# Altium schematic sheet Outputs.SchDoc
size A1
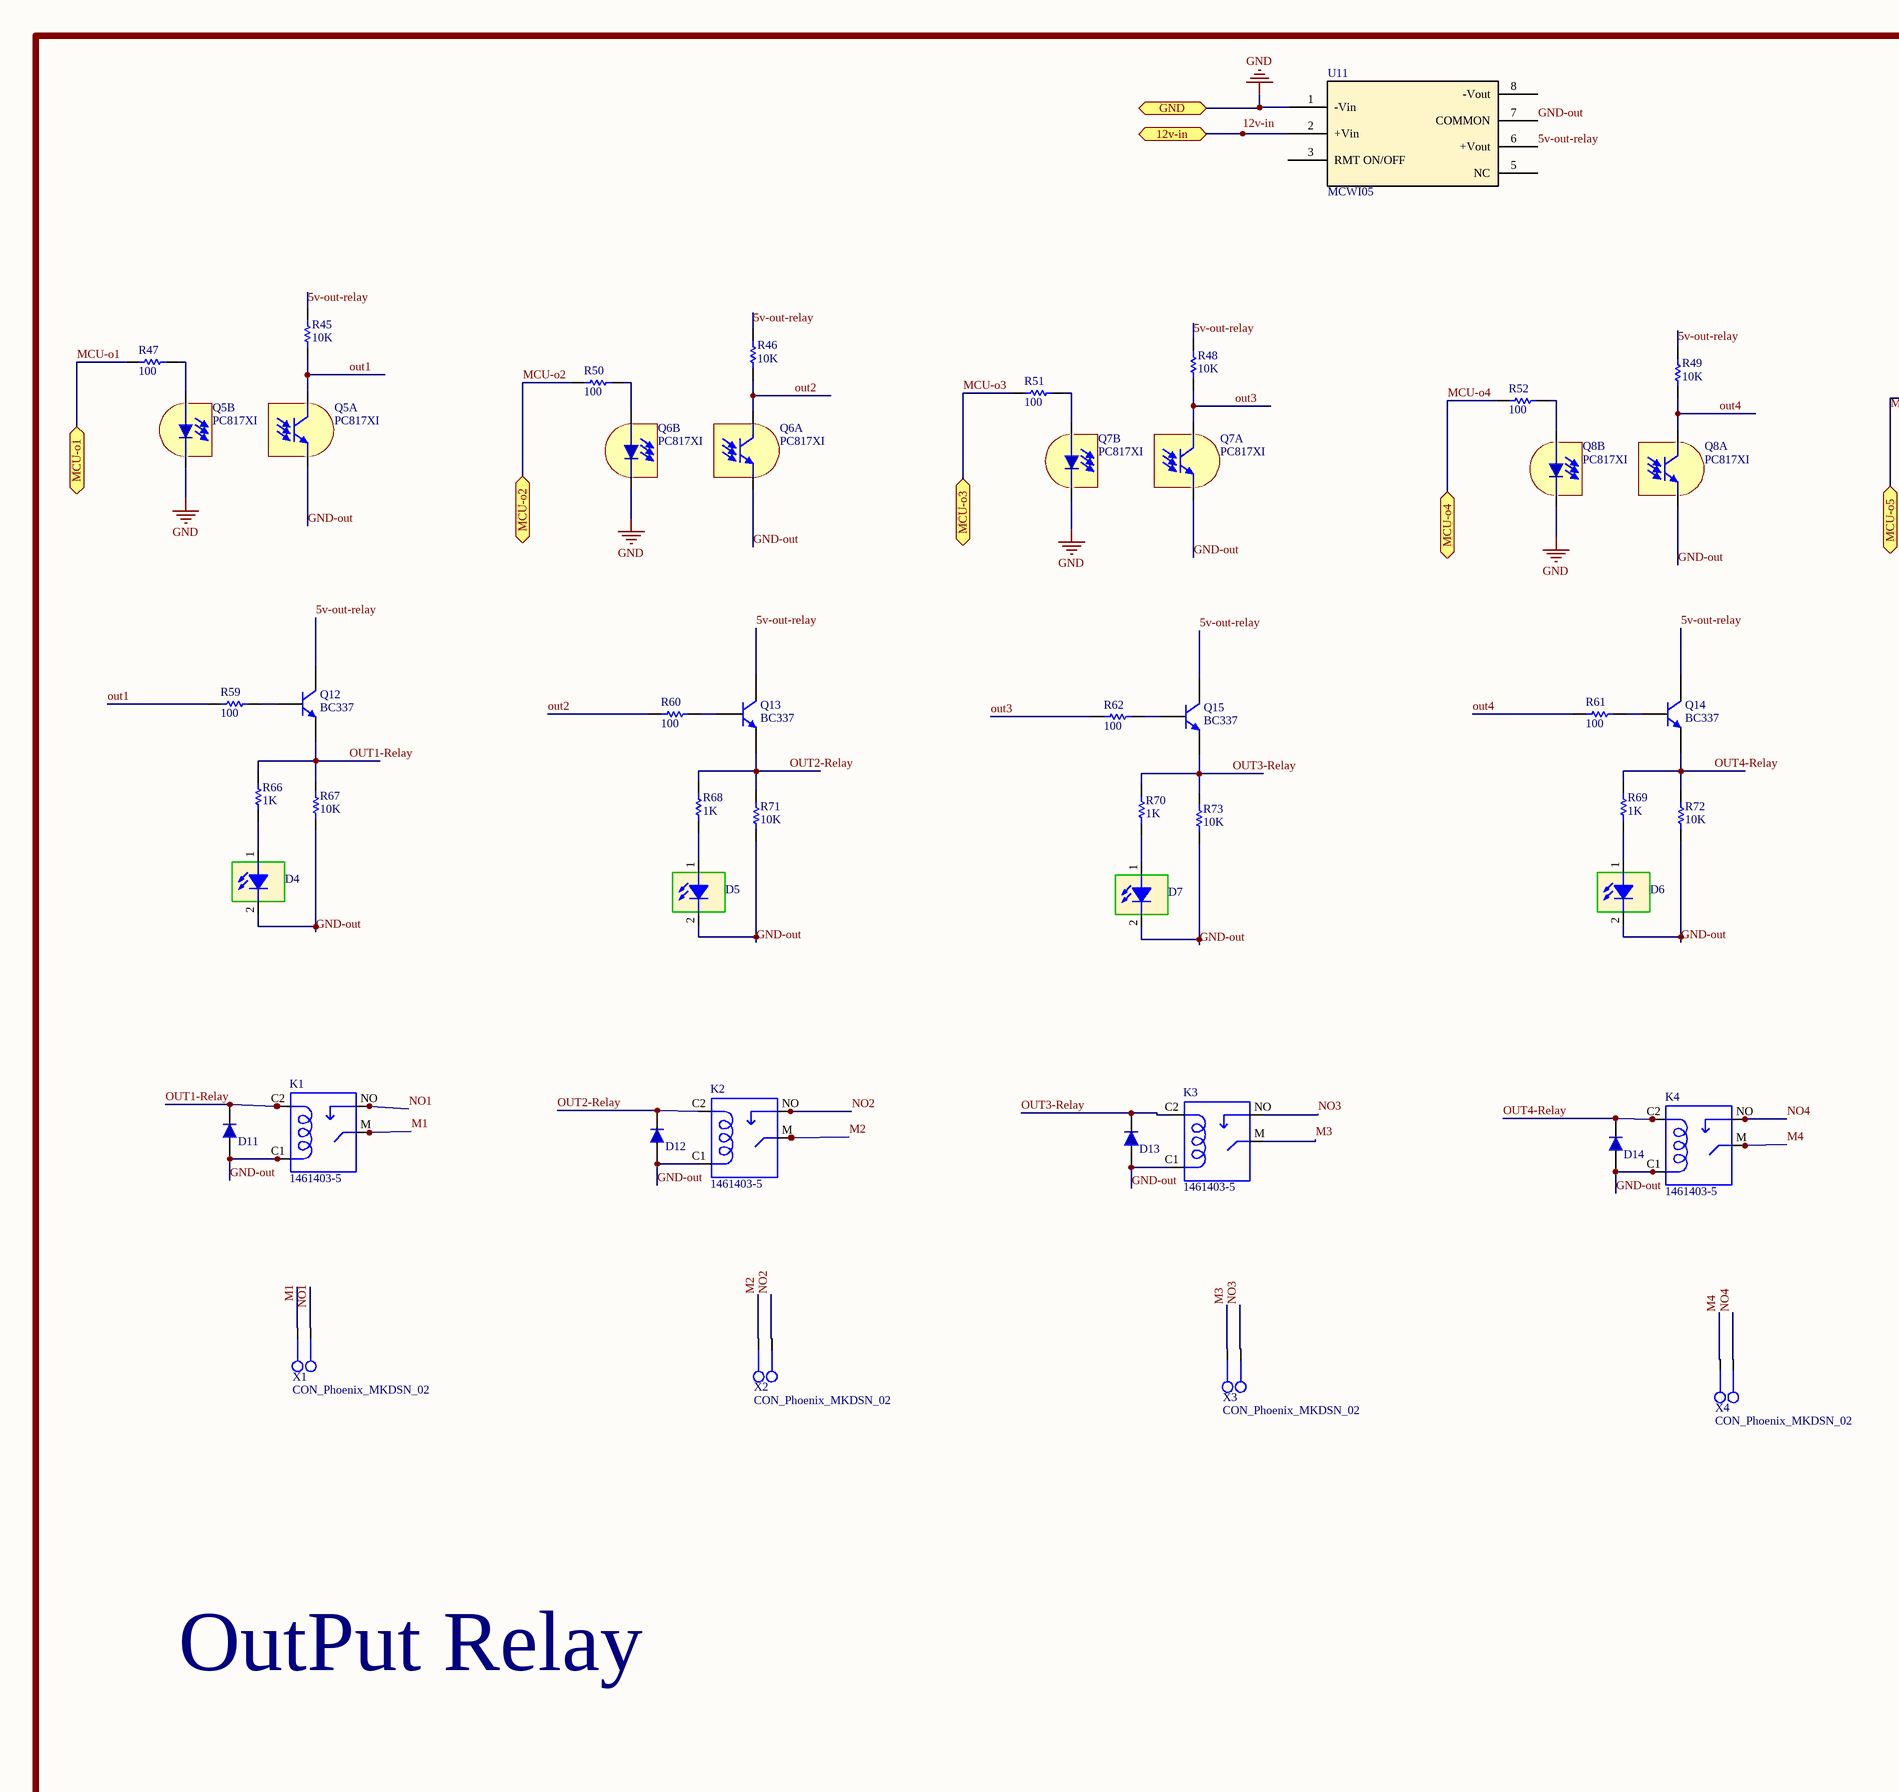
[diagram p0: Outputs.SchDoc, left]
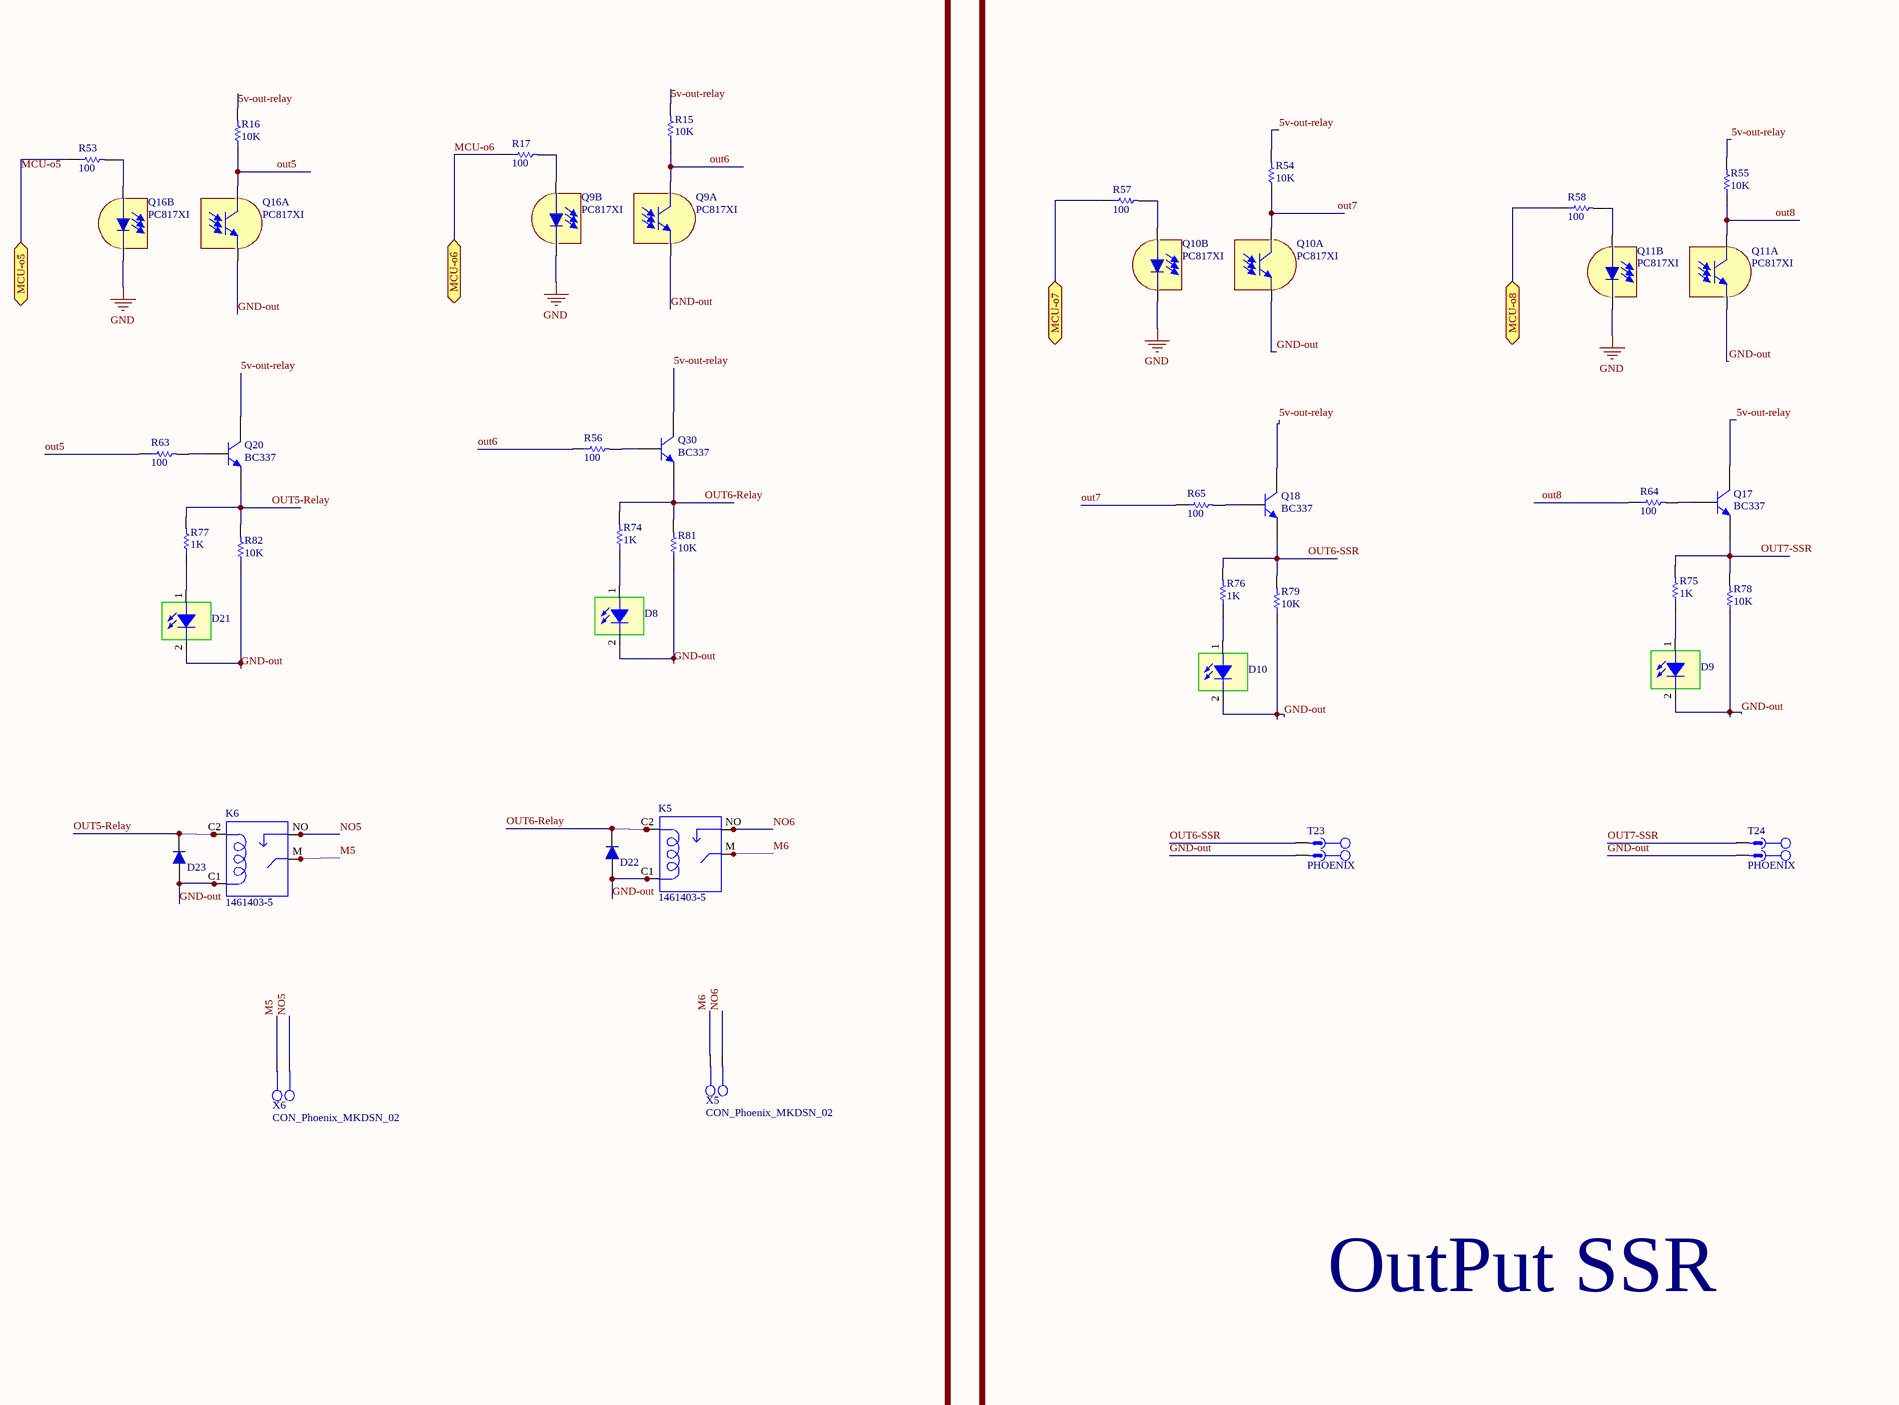
[diagram p1: Outputs.SchDoc, right]

## Parts
D4  SMD 1206 LED  [LED 1206]  (value not drawn)
D5  SMD 1206 LED  [LED 1206]  (value not drawn)
D6  SMD 1206 LED  [LED 1206]  (value not drawn)
D7  SMD 1206 LED  [LED 1206]  (value not drawn)
D8  SMD 1206 LED  [LED 1206]  (value not drawn)
D9  SMD 1206 LED  [LED 1206]  (value not drawn)
D10  SMD 1206 LED  [LED 1206]  (value not drawn)
D11  1n4007  [DIOM4629X24N]  (value not drawn)
D12  1n4007  [DIOM4629X24N]  (value not drawn)
D13  1n4007  [DIOM4629X24N]  (value not drawn)
D14  1n4007  [DIOM4629X24N]  (value not drawn)
D21  SMD 1206 LED  [LED 1206]  (value not drawn)
D22  1n4007  [DIOM4629X24N]  (value not drawn)
D23  1n4007  [DIOM4629X24N]  (value not drawn)
K1  1461403-5  [Miniature_Relay]
K2  1461403-5  [Miniature_Relay]
K3  1461403-5  [Miniature_Relay]
K4  1461403-5  [Miniature_Relay]
K5  1461403-5  [Miniature_Relay]
K6  1461403-5  [Miniature_Relay]
Q5  PC817XI  [SMT Gullwing Lead-Form]  (parts A,B of 2)
Q6  PC817XI  [SMT Gullwing Lead-Form]  (parts A,B of 2)
Q7  PC817XI  [SMT Gullwing Lead-Form]  (parts A,B of 2)
Q8  PC817XI  [SMT Gullwing Lead-Form]  (parts A,B of 2)
Q9  PC817XI  [SMT Gullwing Lead-Form]  (parts A,B of 2)
Q10  PC817XI  [SMT Gullwing Lead-Form]  (parts A,B of 2)
Q11  PC817XI  [SMT Gullwing Lead-Form]  (parts A,B of 2)
Q12  BC337  [SOT23_M]
Q13  BC337  [SOT23_M]
Q14  BC337  [SOT23_M]
Q15  BC337  [SOT23_M]
Q16  PC817XI  [SMT Gullwing Lead-Form]  (parts A,B of 2)
Q17  BC337  [SOT23_M]
Q18  BC337  [SOT23_M]
Q20  BC337  [SOT23_M]
Q30  BC337  [SOT23_M]
R15  10K  [RESC3413X04N]
R16  10K  [RESC3413X04N]
R17  100  [RESC3413X04N]
R45  10K  [RESC3413X04N]
R46  10K  [RESC3413X04N]
R47  100  [RESC3413X04N]
R48  10K  [RESC3413X04N]
R49  10K  [RESC3413X04N]
R50  100  [RESC3413X04N]
R51  100  [RESC3413X04N]
R52  100  [RESC3413X04N]
R53  100  [RESC3413X04N]
R54  10K  [RESC3413X04N]
R55  10K  [RESC3413X04N]
R56  100  [RESC3413X04N]
R57  100  [RESC3413X04N]
R58  100  [RESC3413X04N]
R59  100  [RESC3413X04N]
R60  100  [RESC3413X04N]
R61  100  [RESC3413X04N]
R62  100  [RESC3413X04N]
R63  100  [RESC3413X04N]
R64  100  [RESC3413X04N]
R65  100  [RESC3413X04N]
R66  1K  [RESC3413X04N]
R67  10K  [RESC3413X04N]
R68  1K  [RESC3413X04N]
R69  1K  [RESC3413X04N]
R70  1K  [RESC3413X04N]
R71  10K  [RESC3413X04N]
R72  10K  [RESC3413X04N]
R73  10K  [RESC3413X04N]
R74  1K  [RESC3413X04N]
R75  1K  [RESC3413X04N]
R76  1K  [RESC3413X04N]
R77  1K  [RESC3413X04N]
R78  10K  [RESC3413X04N]
R79  10K  [RESC3413X04N]
R81  10K  [RESC3413X04N]
R82  10K  [RESC3413X04N]
T23  PHOENIX  [MSTB 2,5/2-G-5,08]
T24  PHOENIX  [MSTB 2,5/2-G-5,08]
U11  MCWI05  [MCWI05_PCB]
X1  CON_Phoenix_MKDSN_02  [MSTB 2,5/2-G-5,08]
X2  CON_Phoenix_MKDSN_02  [MSTB 2,5/2-G-5,08]
X3  CON_Phoenix_MKDSN_02  [MSTB 2,5/2-G-5,08]
X4  CON_Phoenix_MKDSN_02  [MSTB 2,5/2-G-5,08]
X5  CON_Phoenix_MKDSN_02  [MSTB 2,5/2-G-5,08]
X6  CON_Phoenix_MKDSN_02  [MSTB 2,5/2-G-5,08]

## Blocks framed on the sheet
OutPut Relay: D4-D8 D11-D14 D21-D23 K1-K6 Q5-Q9 Q12-Q16 Q20 Q30 R15-R17 R45-R53 R56 R59-R63 R66-R74 R77 R81 R82 U11 X1-X6
OutPut SSR: D9 D10 Q10 Q11 Q17 Q18 R54 R55 R57 R58 R64 R65 R75 R76 R78 R79 T23 T24

## Ports
12v-in (bidir), GND (bidir), MCU-o1 (bidir), MCU-o2 (bidir), MCU-o3 (bidir), MCU-o4 (bidir), MCU-o5 (bidir), MCU-o6 (bidir), MCU-o7 (bidir), MCU-o8 (bidir)

## Nets
GND: Q5.2(K) Q6.2(K) Q7.2(K) Q8.2(K) Q9.2(K) Q10.2(K) Q11.2(K) Q16.2(K) U11.1(-Vin) ; port GND
5v-out-relay: Q12.3(C) Q13.3(C) Q14.3(C) Q15.3(C) Q17.3(C) Q18.3(C) Q20.3(C) Q30.3(C) R15.2 R16.2 R45.2 R46.2 R48.2 R49.2 R54.2 R55.2 U11.6(+Vout)
12v-in: U11.2(+Vin) ; port 12v-in
GND-out: D4.2 D5.2 D6.2 D7.2 D8.2 D9.2 D10.2 D11.1 D12.1 D13.1 D14.1 D21.2 D22.1 D23.1 K1.C1 K2.C1 K3.C1 K4.C1 K5.C1 K6.C1 Q5.3(E) Q6.3(E) Q7.3(E) Q8.3(E) Q9.3(E) Q10.3(E) Q11.3(E) Q16.3(E) R67.1 R71.1 R72.1 R73.1 R78.1 R79.1 R81.1 R82.1 T23.2 T24.2 U11.7(COMMON)
M1: K1.M X1.1
M2: K2.M X2.1
M3: K3.M X3.1
M4: K4.M X4.1
M5: K6.M X6.1
M6: K5.M X5.1
MCU-o1: R47.1 ; port MCU-o1
MCU-o2: R50.1 ; port MCU-o2
MCU-o3: R51.1 ; port MCU-o3
MCU-o4: R52.1 ; port MCU-o4
MCU-o5: R53.1 ; port MCU-o5
MCU-o6: R17.1 ; port MCU-o6
MCU-o7: R57.1 ; port MCU-o7
MCU-o8: R58.1 ; port MCU-o8
NO1: K1.NO X1.2
NO2: K2.NO X2.2
NO3: K3.NO X3.2
NO4: K4.NO X4.2
NO5: K6.NO X6.2
NO6: K5.NO X5.2
out1: Q5.4(C) R45.1 R59.1
OUT1-Relay: D11.2 K1.C2 Q12.2(E) R66.2 R67.2
out2: Q6.4(C) R46.1 R60.1
OUT2-Relay: D12.2 K2.C2 Q13.2(E) R68.2 R71.2
out3: Q7.4(C) R48.1 R62.1
OUT3-Relay: D13.2 K3.C2 Q15.2(E) R70.2 R73.2
out4: Q8.4(C) R49.1 R61.1
OUT4-Relay: D14.2 K4.C2 Q14.2(E) R69.2 R72.2
out5: Q16.4(C) R16.1 R63.1
OUT5-Relay: D23.2 K6.C2 Q20.2(E) R77.2 R82.2
out6: Q9.4(C) R15.1 R56.1
OUT6-Relay: D22.2 K5.C2 Q30.2(E) R74.2 R81.2
OUT6-SSR: Q18.2(E) R76.2 R79.2 T23.1
out7: Q10.4(C) R54.1 R65.1
OUT7-SSR: Q17.2(E) R75.2 R78.2 T24.1
out8: Q11.4(C) R55.1 R64.1
NetD4_1: D4.1 R66.1
NetD5_1: D5.1 R68.1
NetD6_1: D6.1 R69.1
NetD7_1: D7.1 R70.1
NetD8_1: D8.1 R74.1
NetD9_1: D9.1 R75.1
NetD10_1: D10.1 R76.1
NetD21_1: D21.1 R77.1
NetQ5_1: Q5.1(A) R47.2
NetQ6_1: Q6.1(A) R50.2
NetQ7_1: Q7.1(A) R51.2
NetQ8_1: Q8.1(A) R52.2
NetQ9_1: Q9.1(A) R17.2
NetQ10_1: Q10.1(A) R57.2
NetQ11_1: Q11.1(A) R58.2
NetQ12_1: Q12.1(B) R59.2
NetQ13_1: Q13.1(B) R60.2
NetQ14_1: Q14.1(B) R61.2
NetQ15_1: Q15.1(B) R62.2
NetQ16_1: Q16.1(A) R53.2
NetQ17_1: Q17.1(B) R64.2
NetQ18_1: Q18.1(B) R65.2
NetQ20_1: Q20.1(B) R63.2
NetQ30_1: Q30.1(B) R56.2

Not connected (* = marked no-connect by the designer): U11 3(RMT_ON/OFF) 5(NC) 8(-Vout)

## Library data of the parts
D4-D10 D21 = LED SMD 1206
D11-D14 D22 D23 = 1n4007 SMD M7: Standard Rectifiers; Part. No: M7; Manufacturer: DC COMPONENTS; Designer: Abbas Basereh; Link: http://www.tme.eu/en/details/m7/smd-universal-diodes/dc-components/; Link: https://www.aliexpress.com/item/Smd-tube-1n4007-m7-SMA/1213719741.html?spm=2114.01010208.3.1.ZyZ7bC&ws_ab_test=searchweb0_0,searchweb201602_4_10065_10068_10084_10083_10080_10082_10081_10060_10061_10062_10056_10055_10054_10059_10099_10078_10079_427_10073_10103_10102_10096_10052_10050_10051,searchweb201603_4&btsid=db2be5ca-e560-400a-b91c-484ab5ee228b; Data: 16-12-2016
K1-K6 = 1461403-5: Electromechanical Relay 24VDC 2.8KOhm 8A SPST-NO_18.2x10.2x14.7_mm THT Industrial Relay; MF: TE Connectivity; Price: None; Package: None; TE_purchase_URL: https://www.te.com/usa-en/product-1461403-5.html?te_bu=Cor&te_type=disp&te_campaign=seda_glo_cor-seda-global-disp-prtnr-fy19-seda-model-bom-cta_sma-317_1&elqCampaignId=32493; Value: *; MP: 1461403-5; Availability: Unavailable; SnapEDA_Link: https://www.snapeda.com/parts/1461403-5/TE%20Connectivity%20Potter%20%26%20Brumfield%20Relays/view-part/2370888/?ref=snap
Q5-Q11 Q16 = PC817XI: DIP 4pin General Purpose  Photocoupler; Published: 2017-2-27; DatasheetVersion: 2017-2-27; PackageVersion: 2017-2-27; PackageReference: SMT Gullwing Lead-Form; Publisher: Abbas Basereh; PackageDescription: SOP, 4-Leads, Body 4/65x6/75mm, Pitch 2/54mm, IPC Medium Density designer:abbas basereh; ComponentLink1Description: Manufacturer Link; ComponentLink1URL: http://www.roboeq.ir/files/id/233/name/PC817.pdf/; ComponentLink2Description: DIP 4pin General Purpose
Q12-Q15 Q17 Q18 Q20 Q30 = BC337: 45 V, 500 mA NPN general-purpose transistors; Published: 2017-2-8; LatestRevisionDate: 2017; LatestRevisionNote: IPC-7351 Footprint Added.; DatasheetVersion: 2017; PackageVersion: 2017-2-8; PackageReference: SOT23; Publisher: Abbas Basereh; PackageDescription: 3-Pin SOT-23 Package 0.95 mm Pitch, 2.3 mm Lead Span; ComponentLink1Description: Manufacturer Link; ComponentLink1URL: http://www.nxp.com/; ComponentLink2Description: Datasheet; ComponentLink2URL: http://www.nxp.com/
R15-R17 R45-R79 R81 R82 = RES
T23 T24 = CON_Phoenix_MSTB_02: 2 Pitch: 5.08 mm Color: green Contact surface: Tin Assembly; Manufacturer: PHOENIX CONTACT; Connector type: PCB Terminal Block; designer: ABBAS BASEREH; Max Current: 12 A; Positions: 2; Voltage: 320 V; Category: Connector; ComponentLink1Description: Header, Nominal current: 12 A Rated voltage (III/2): 320 V Number of positions: 2 Pitch: 5.08 mm Color: green Contact surface: Tin Assembly: Soldering  DESIGNER:ABBAS BASEREH; ComponentLink2Description: Reference; Mounting Technology: Through-Hole; Pin Count: 2; Revision 1: 2017-3-1; Status: Unreleased; PART.NO: PHOENIX
X1-X6 = CON_Phoenix_MKDSN_02: Manufacturer: PHOENIX CONTACT; Company: SJ Libraries; Connector type: PCB Terminal Block; designer: Eng. Saeid Jorablo; Max Current: 13.5 A; Positions: 2; Revision 1: 2012/10/1 : Adding Model; Voltage: 400 V; Category: Connector; ComponentLink1Description: Datasheet; ComponentLink2Description: Reference; HelpURL: http://s3.picofile.com/file/7443264187/Coming_Soon_logo.gif; Mounting Technology: Through-Hole; Pin Count: 2; Publisher: SJ UnLimited; Status: Unreleased; Update: 2012/10/1